# Altium schematic sheet Switches1.1.SchDoc
size A2
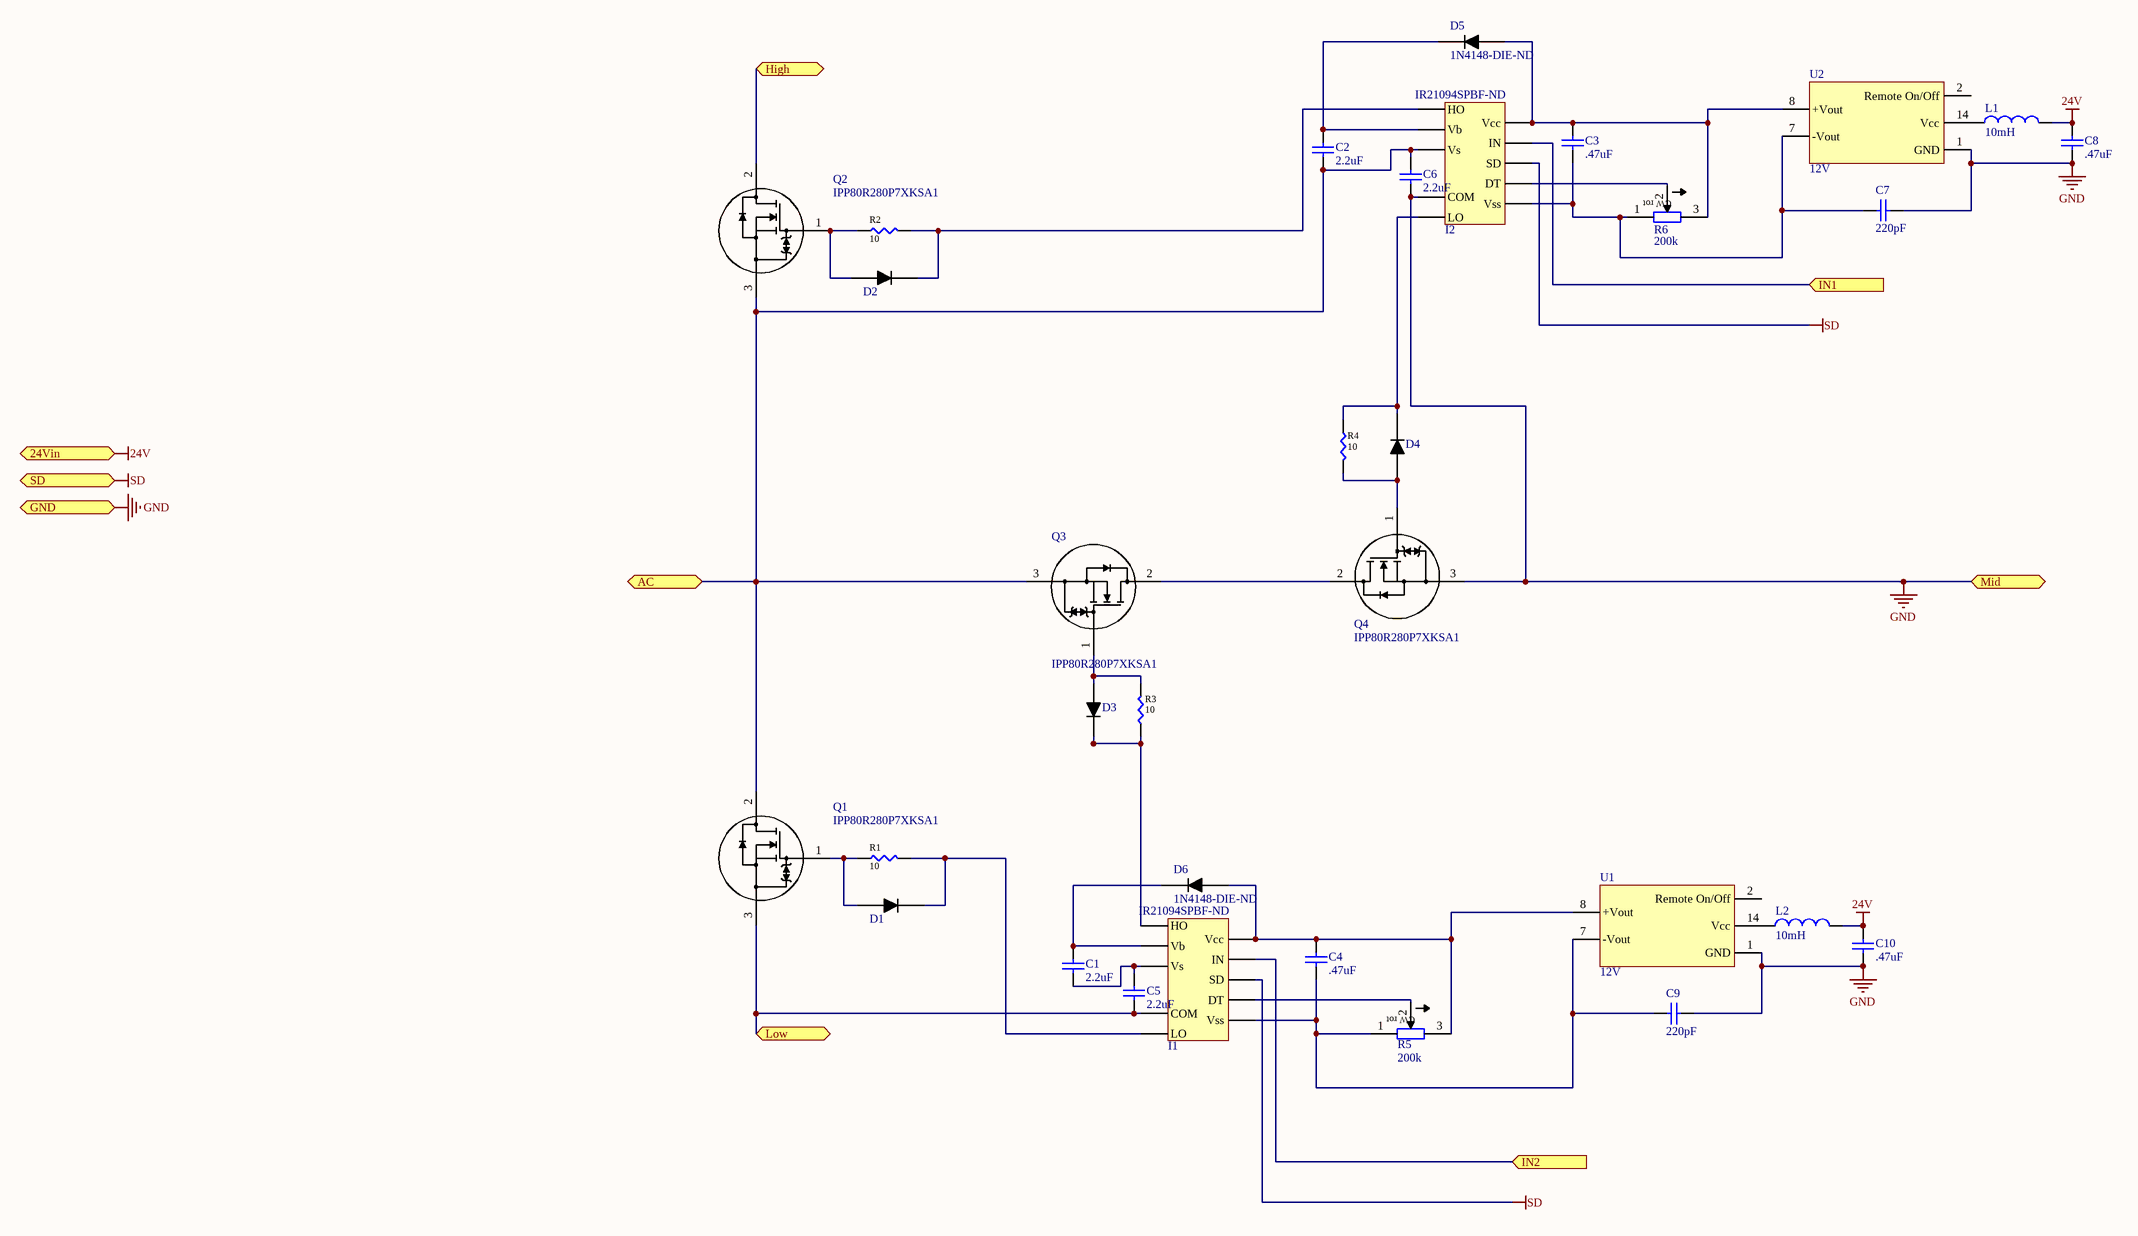
[diagram p0: Switches1.1.SchDoc]

## Parts
C1  value 2.2uF  [RAD-0.3]  (hidden comment: Cap)
C2  value 2.2uF  [RAD-0.3]  (hidden comment: Cap)
C3  value .47uF  [RAD-0.3]  (hidden comment: Cap)
C4  value .47uF  [RAD-0.3]  (hidden comment: Cap)
C5  value 2.2uF  [RAD-0.3]  (hidden comment: Cap)
C6  value 2.2uF  [RAD-0.3]  (hidden comment: Cap)
C7  value 220pF  [RAD-0.3]  (hidden comment: Cap)
C8  value .47uF  [RAD-0.3]  (hidden comment: Cap)
C9  value 220pF  [RAD-0.3]  (hidden comment: Cap)
C10  value .47uF  [RAD-0.3]  (hidden comment: Cap)
D1  1N4148  [Diode 1n4148]  (value not drawn)
D2  1N4148  [Diode 1n4148]  (value not drawn)
D3  1N4148  [DO-35_02]  (value not drawn)
D4  1N4148  [DO-35_02]  (value not drawn)
D5  Supplier Part Number 1: 1N4148-DIE-ND  [DO-35_02]  (hidden comment: 1N4148)
D6  Supplier Part Number 1: 1N4148-DIE-ND  [DO-35_02]  (hidden comment: 1N4148)
I1  Supplier Part Number 1: IR21094SPBF-ND  [DIP14]  (hidden comment: IR21094)
I2  Supplier Part Number 1: IR21094SPBF-ND  [DIP14]  (hidden comment: IR21094)
L1  value 10mH  [TCK-047]  (hidden comment: Inductor)
L2  value 10mH  [TCK-047]  (hidden comment: Inductor)
Q1  IPP80R280P7XKSA1  [IPP65R110CFD]
Q2  IPP80R280P7XKSA1  [IPP65R110CFD]
Q3  IPP80R280P7XKSA1  [IPP65R110CFD]
Q4  IPP80R280P7XKSA1  [IPP65R110CFD]
R1  10  [R_1206]
R2  10  [R_1206]
R3  10  [R_1206]
R4  10  [R_1206]
R5  200k  [AXIAL-0.6]
R6  200k  [AXIAL-0.6]
U1  12V  [PID DC-DC Converter - duplicate]
U2  12V  [PID DC-DC Converter - duplicate]

## Ports
24Vin, AC, GND, High, IN1 (in), IN2 (in), Low, Mid, SD (in)

## Nets
24V: C8.2 C10.2 L1.1 L2.1 ; port 24Vin
GND: C6.1 C7.2 C8.1 C9.2 C10.1 I2.6(COM) Q4.3(Source) U1.1(GND) U2.1(GND) ; port Mid, port GND
SD: I1.3(SD) I2.3(SD) ; port SD
AC: C2.1 C6.2 I2.8(Vs) Q1.2(Drain) Q2.3(Source) Q3.3(Source) ; port AC
High: Q2.2(Drain) ; port High
IN1: I2.2(IN) ; port IN1
IN2: I1.2(IN) ; port IN2
Low: C5.1 I1.6(COM) Q1.3(Source) ; port Low
NetC1_1: C1.1 C5.2 I1.8(Vs)
NetC1_2: C1.2 D6.1(Cathode) I1.13(Vb)
NetC2_2: C2.2 D5.1(Cathode) I2.13(Vb)
NetC3_1: C3.1 C7.1 I2.5(Vss) R6.1 U2.7(-Vout)
NetC3_2: C3.2 D5.2(Anode) I2.1(Vcc) R6.3 U2.8(+Vout)
NetC4_1: C4.1 C9.1 I1.5(Vss) R5.1 U1.7(-Vout)
NetC4_2: C4.2 D6.2(Anode) I1.1(Vcc) R5.3 U1.8(+Vout)
NetD1_1: D1.1(Cathode) I1.7(LO) R1.1
NetD1_2: D1.2(Anode) Q1.1(Gate) R1.2
NetD2_1: D2.1(Cathode) I2.12(HO) R2.1
NetD2_2: D2.2(Anode) Q2.1(Gate) R2.2
NetD3_1: D3.1(Cathode) I1.12(HO) R3.2
NetD3_2: D3.2(Anode) Q3.1(Gate) R3.1
NetD4_1: D4.1(Cathode) I2.7(LO) R4.2
NetD4_2: D4.2(Anode) Q4.1(Gate) R4.1
NetI1_4: I1.4(DT) R5.2
NetI2_4: I2.4(DT) R6.2
NetL1_2: L1.2 U2.14(Vcc)
NetL2_2: L2.2 U1.14(Vcc)
NetQ3_2: Q3.2(Drain) Q4.2(Drain)

Not connected (* = marked no-connect by the designer): U1 2(Remote_On/Off); U2 2(Remote_On/Off)

## Notes on the sheet
- (in symbol Res Adj2) CW rot

## Library data of the parts
C1-C10 = Cap: Capacitor; Published: 8-Jun-2000; LatestRevisionDate: 17-Jul-2002; LatestRevisionNote: Re-released for DXP Platform.; PackageReference: RAD-0.3; Publisher: Altium Limited; PackageDescription: Radial Cap, Thru-Hole; 2 Leads; 0.3 in Pin Spacing
D1-D6 = 1N4148: Diode; Manufacturer: Fairchild Semiconductor; Forward Voltage: 1V; Reverse Recovery Time: 4ns; Element Configuration: Single; Polarity: Standard; Current Rating: 200mA; Capacitance: 4pF; Voltage Rating (DC): 100V; Peak Non-Repetitive Surge Current: 4A; Max Forward Surge Current (Ifsm): 1A; Max Power Dissipation: 500mW; Peak Reverse Current: 5uA; Outside Diameter: 1.85mm; Supplier 1: Digi-Key; Manufacturer Part Number: 1N4148; Stock 1: 0; Pricing 1: 25=4 (USD); Mount: Through Hole; Number of Pins: 2; Weight: 0.01lb; Contact Plating: Tin; Min Operating Temperature: -65°C; Max Operating Temperature: 175°C; Packaging: Bulk; Output Current: 200mA; Forward Current: 200mA; Max Repetitive Reverse Voltage (Vrrm): 100V; Package Quantity: 2000; Recovery Time: 4ns; Max Surge Current: 4A; Reverse Voltage (DC): 100V; Average Rectified Current: 200mA; Power Dissipation: 500mW; Diameter: 1.91mm; Length: 4.56mm; Height: 4.56mm; Width: 1.91mm; Radiation Hardening: No; Lead Free: Lead Free; REACH SVHC: No SVHC; ComponentLink1URL: https://datasheet.ciiva.com/910/1n914-910546.pdf; ComponentLink1Description: https://datasheet.ciiva.com/910/1n914-910546.pdf; ComponentLink2URL: https://datasheet.ciiva.com/1242/1716967-1242233.pdf; ComponentLink2Description: https://datasheet.ciiva.com/1242/1716967-1242233.pdf; ComponentLink3URL: https://datasheet.ciiva.com/3304/fdll914b-3304217.pdf; ComponentLink3Description: https://datasheet.ciiva.com/3304/fdll914b-3304217.pdf; ComponentLink4URL: https://datasheet.ciiva.com/25951/fdll914b-25951516.pdf; ComponentLink4Description: https://datasheet.ciiva.com/25951/fdll914b-25951516.pdf; ComponentLink5URL: https://datasheet.ciiva.com/27049/743285-27049708.pdf; ComponentLink5Description: https://datasheet.ciiva.com/27049/743285-27049708.pdf; ComponentLink6URL: https://datasheet.ciiva.com/16740/1n4148-16740829.pdf; ComponentLink6Description: https://datasheet.ciiva.com/16740/1n4148-16740829.pdf
  D1-D4: Supplier Part Number 1: 1N4148-DIE-ND
I1 I2 = IR21094: HALF-BRIDGE DRIVER; Manufacturer: International Rectifier; Manufacturer Part Number: IR21094SPBF; Max Output Current: 350mA; Number of Drivers: 2; Output Current: 120mA; Max Supply Voltage: 20V; Min Supply Voltage: 10V; Output Voltage: 620V; Power Dissipation: 1W; Rise Time: 220ns; Nominal Supply Current: 1.6mA; Propagation Delay: 950ns; Fall Time: 80ns; Turn-Off Delay Time: 200ns; Turn-On Delay Time: 70ns; Supplier 1: Digikey; Stock 1: 446; Pricing 1: 1=3.14, 10=2.145, 50=1.8068, 100=1.7065, 250=1.5988, 500=1.5299, 1000=1.4703, 2500=1.4003, 5000=1.3512 (USD); Mount: Surface Mount; Case/Package: SOIC; Number of Pins: 14; Min Operating Temperature: -40°C; Max Operating Temperature: 125°C; Package Quantity: 55; Packaging: Rail/Tube; Number of Outputs: 2; Max Power Dissipation: 1W; Max Supply Current: 1.6mA; Max Output Voltage: 20V; Min Output Voltage: 10V; Termination: SMD/SMT; Length: 8.74mm; Height: 1.5mm; Width: 3.99mm; Radiation Hardening: No; Lead Free: Lead Free; REACH SVHC: No SVHC; ComponentLink1URL: https://datasheet.ciiva.com/1951/ir2109-1951152.pdf; ComponentLink1Description: https://datasheet.ciiva.com/1951/ir2109-1951152.pdf; ComponentLink2URL: https://datasheet.ciiva.com/4898/ir2109-77031-4898849.pdf; ComponentLink2Description: https://datasheet.ciiva.com/4898/ir2109-77031-4898849.pdf; ComponentLink3URL: https://datasheet.ciiva.com/15110/getdatasheetpartid-487842-15110407.pdf; ComponentLink3Description: https://datasheet.ciiva.com/15110/getdatasheetpartid-487842-15110407.pdf; ComponentLink4URL: https://datasheet.ciiva.com/1499/ir2109-1499485.pdf; ComponentLink4Description: https://datasheet.ciiva.com/1499/ir2109-1499485.pdf; ComponentLink5URL: https://datasheet.ciiva.com/3227/ir2109-3227182.pdf; ComponentLink5Description: https://datasheet.ciiva.com/3227/ir2109-3227182.pdf
L1 L2 = Inductor: Code_IEC: 1005; Published: 8-Jun-2000; LatestRevisionDate: 29-May-2009; LatestRevisionNote: IPC-7351 Footprint Added.; PackageReference: 0402-A; Publisher: Altium Limited; PackageDescription: Chip Inductor; Code_JEITA: 0402
Q1-Q3 = IPP80R280P7XKSA1: MOSFET; Manufacturer: Infineon; Supplier 1: Digikey; Manufacturer Part Number: IPP80R280P7XKSA1; Stock 1: 370; Pricing 1: 1=3.89, 10=3.495, 100=2.8638, 500=2.4379, 1000=2.0561 (USD); Supplier Part Number 1: IPP80R280P7XKSA1-ND
Q4 = IPP80R280P7XKSA1: Manufacturer: Infineon; Supplier 1: Digikey; Manufacturer Part Number: IPP80R280P7XKSA1; Stock 1: 370; Pricing 1: 1=3.89, 10=3.495, 100=2.8638, 500=2.4379, 1000=2.0561 (USD); Supplier Part Number 1: IPP80R280P7XKSA1-ND
R1-R4 = RES_SMD1: RES SMD 1% 1/4W 1206; Manufacturer: Panasonic Electronic Components; Manufacturer Part Number: ERJ-8ENF9101V; Value: 9.1k; Power (Watts): 0.25W, 1/4W; Temperature Coefficient: ±100ppm/°C; Supplier 1: Digi-Key; RoHS: RoHS Compliant; Category: Resistors; Stock 1: 17632; Pricing 1: 1=0.15, 50=0.0424, 100=0.0313, 250=0.02384, 500=0.01908, 1000=0.01404 (CAD); Packaging: Digi-Reel®; Part Status: Active; Tolerance: ±1%; Composition: Thick Film; Features: Automotive AEC-Q200; Operating Temperature: -55°C ~ 155°C; Package / Case: 1206 (3216 Metric); Supplier Device Package: 1206; Size / Dimension: 0.126" L x 0.063" W (3.20mm x 1.60mm); Height: 0.028" (0.70mm); Number of Terminations: 2; Failure Rate: -; ComponentLink1URL: http://industrial.panasonic.com/www-cgi/jvcr13pz.cgi?E+PZ+3+AOA0002+ERJ8ENF9101V+7+WW; ComponentLink1Description: http://industrial.panasonic.com/www-cgi/jvcr13pz.cgi?E+PZ+3+AOA0002+ERJ8ENF9101V+7+WW; Supplier Part Number 1: P9.10KFDKR-ND
R5 R6 = Res Adj2: Variable Resistor; Manufacturer: Nidec Copal; Manufacturer Part Number: CT-6EP103; Set Position: 0.5; Resistance: 10KR; Tolerance: 10%; Number of Turns: 1; Max Power Dissipation: 500mW; Temperature Coefficient: 100ppm/°C; Published: 8-Jun-2000; LatestRevisionDate: 17-Jul-2002; LatestRevisionNote: Re-released for DXP Platform.; PackageReference: AXIAL-0.6; Publisher: Altium Limited; PackageDescription: Axial Device, Thru-Hole; 2 Leads; 0.6 in Pin Spacing; Supplier 1: Digikey; Stock 1: 31633; Pricing 1: 1=0.79, 10=0.711, 25=0.6428, 50=0.6196, 100=0.5852, 250=0.5623, 500=0.5279, 1000=0.4361, 5000=0.3557 (USD); Mount: Through Hole; Weight: 510mg; Colour: Blue; Contact Plating: Tin; Min Operating Temperature: -55°C; Max Operating Temperature: 120°C; Packaging: Bulk; Composition: Potentiometer; Termination: PC Pins; Length: 0.228inch; Lead Free: Lead Free; ComponentLink1URL: https://datasheet.ciiva.com/2156/ct-6-2156122.pdf; ComponentLink1Description: https://datasheet.ciiva.com/2156/ct-6-2156122.pdf; Supplier Part Number 1: CT6EP103-ND
U1 U2 = TDR 3-2412: 12V DC-DC Converter; Manufacturer: Traco Power; Nominal Input Voltage: 24V; Output Current: 250mA; Number of Outputs: 1; Efficiency: 82%; Min Input Voltage: 18V; Max Input Voltage: 36V; Max Output Power: 3W; Isolation Voltage: 1.5kV; Supplier 1: Mouser; Supplier Part Number 1: 495-TDR3-2412; Manufacturer Part Number: TDR3-2412; Stock 1: 9; Pricing 1: 1=31.28, 10=29.54, 50=25.71, 100=25.71, 1000=25.71, 10000=25.71 (USD); Case/Package: DIP; Min Operating Temperature: -40°C; Max Operating Temperature: 85°C; Output Voltage: 12V; Nominal Output Voltage: 12V; Max Output Current: 250mA; Min Input Voltage (DC): 18V; Max Input Voltage (DC): 36V; Voltage - Output 1: 12V; Current - Output 1: 250mA; Length: 18.9mm; Height: 8.7mm; Width: 12.8mm; Depth: 18.9mm; REACH SVHC: No SVHC; ComponentLink1URL: http://uk.rs-online.com/webdocs/0e35/0900766b80e35ed7.pdf; ComponentLink1Description: http://uk.rs-online.com/webdocs/0e35/0900766b80e35ed7.pdf; ComponentLink2URL: http://www.farnell.com/datasheets/1763516.pdf; ComponentLink2Description: http://www.farnell.com/datasheets/1763516.pdf; ComponentLink3URL: http://docs-usa.electrocomponents.com/techlib:/itc_doclist_US.htm?stockno=7065593; ComponentLink3Description: http://docs-usa.electrocomponents.com/techlib:/itc_doclist_US.htm?stockno=7065593